# Altium schematic sheet Tetris.SchDoc
size B; DocumentNumber: 1; SheetNumber: 1; SheetTotal: 1
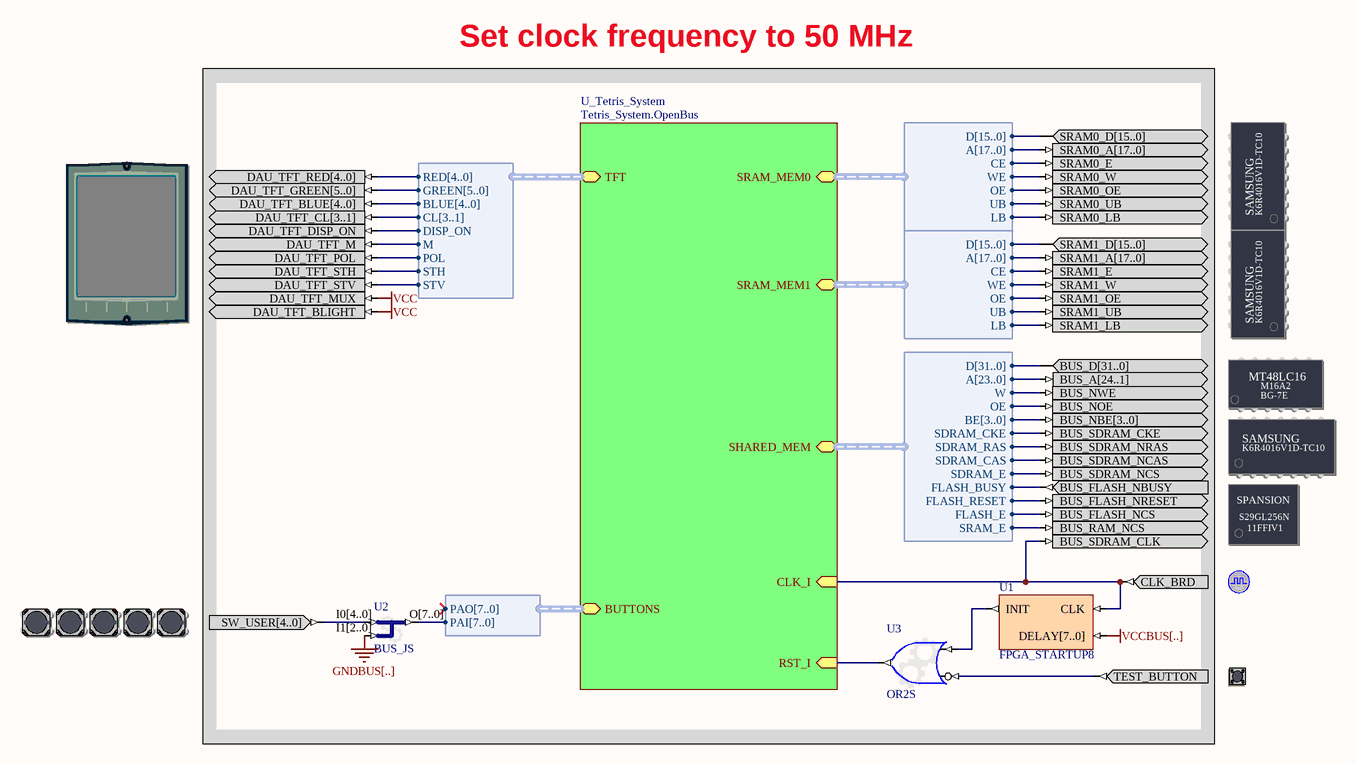
[diagram p0: Tetris.SchDoc]

## Parts
(Parts that share a designator on the sheet are numbered #1, #2 ... from top to bottom, then left to right.)
?#1  SRAM_DAUGHTER0  (value not drawn)
?#2  TFT_LCD  (value not drawn)
?#3  SRAM_DAUGHTER1  (value not drawn)
?#4  SHARED_MEM_DAUGHTER  (value not drawn)
?#5  CLOCK_BOARD  (value not drawn)
?#6  USER_BUTTONS  (value not drawn)
?#7  TEST_BUTTON  (value not drawn)
U1  FPGA_STARTUP8
U2  BUS_JS
U3  OR2S

## Blocks framed on the sheet
Set clock frequency to 50 MHz: ?#1-?#7 U1-U3

## Sub-sheets
U_Tetris_System = Tetris_System.OpenBus: CLK_I (in), RST_I (in), BUTTONS (harness WB_PRTIO_IO_1_1), TFT (harness VGA32_TFT), SRAM_MEM0 (harness WB_MEM_CTRL_SRAM16_A18), SRAM_MEM1 (harness WB_MEM_CTRL_SRAM16_A18), SHARED_MEM (harness WB_SHARED_MEM_CTRL)

## Harnesses
VGA32_TFT: RED[4..0], GREEN[5..0], BLUE[4..0], CL[3..1], DISP_ON, M, POL, STH, STV
WB_PRTIO_IO_1_1: PAO[7..0], PAI[7..0]
WB_MEM_CTRL_SRAM16_A18: D[15..0], A[17..0], CE, WE, OE, UB, LB
WB_SHARED_MEM_CTRL: D[31..0], A[23..0], W, OE, BE[3..0], SDRAM_CKE, SDRAM_RAS, SDRAM_CAS, SDRAM_E, FLASH_BUSY, FLASH_RESET, FLASH_E, SRAM_E

## Nets
GNDBUS[..]: U2.I1[2..0]
VCC: ?#2.DAU_TFT_BLIGHT ?#2.DAU_TFT_MUX
VCCBUS[..]: U1.DELAY[7..0]
Net?#1_SRAM0_A[17..0]: ?#1.SRAM0_A[17..0] ; sheet U_Tetris_System/SRAM_MEM0.A[17..0]
Net?#1_SRAM0_D[15..0]: ?#1.SRAM0_D[15..0] ; sheet U_Tetris_System/SRAM_MEM0.D[15..0]
Net?#1_SRAM0_E: ?#1.SRAM0_E ; sheet U_Tetris_System/SRAM_MEM0.CE
Net?#1_SRAM0_LB: ?#1.SRAM0_LB ; sheet U_Tetris_System/SRAM_MEM0.LB
Net?#1_SRAM0_OE: ?#1.SRAM0_OE ; sheet U_Tetris_System/SRAM_MEM0.OE
Net?#1_SRAM0_UB: ?#1.SRAM0_UB ; sheet U_Tetris_System/SRAM_MEM0.UB
Net?#1_SRAM0_W: ?#1.SRAM0_W ; sheet U_Tetris_System/SRAM_MEM0.WE
Net?#2_DAU_TFT_BLUE[4..0]: ?#2.DAU_TFT_BLUE[4..0] ; sheet U_Tetris_System/TFT.BLUE[4..0]
Net?#2_DAU_TFT_CL[3..1]: ?#2.DAU_TFT_CL[3..1] ; sheet U_Tetris_System/TFT.CL[3..1]
Net?#2_DAU_TFT_DISP_ON: ?#2.DAU_TFT_DISP_ON ; sheet U_Tetris_System/TFT.DISP_ON
Net?#2_DAU_TFT_GREEN[5..0]: ?#2.DAU_TFT_GREEN[5..0] ; sheet U_Tetris_System/TFT.GREEN[5..0]
Net?#2_DAU_TFT_M: ?#2.DAU_TFT_M ; sheet U_Tetris_System/TFT.M
Net?#2_DAU_TFT_POL: ?#2.DAU_TFT_POL ; sheet U_Tetris_System/TFT.POL
Net?#2_DAU_TFT_RED[4..0]: ?#2.DAU_TFT_RED[4..0] ; sheet U_Tetris_System/TFT.RED[4..0]
Net?#2_DAU_TFT_STH: ?#2.DAU_TFT_STH ; sheet U_Tetris_System/TFT.STH
Net?#2_DAU_TFT_STV: ?#2.DAU_TFT_STV ; sheet U_Tetris_System/TFT.STV
Net?#3_SRAM1_A[17..0]: ?#3.SRAM1_A[17..0] ; sheet U_Tetris_System/SRAM_MEM1.A[17..0]
Net?#3_SRAM1_D[15..0]: ?#3.SRAM1_D[15..0] ; sheet U_Tetris_System/SRAM_MEM1.D[15..0]
Net?#3_SRAM1_E: ?#3.SRAM1_E ; sheet U_Tetris_System/SRAM_MEM1.CE
Net?#3_SRAM1_LB: ?#3.SRAM1_LB ; sheet U_Tetris_System/SRAM_MEM1.LB
Net?#3_SRAM1_OE: ?#3.SRAM1_OE ; sheet U_Tetris_System/SRAM_MEM1.OE
Net?#3_SRAM1_UB: ?#3.SRAM1_UB ; sheet U_Tetris_System/SRAM_MEM1.UB
Net?#3_SRAM1_W: ?#3.SRAM1_W ; sheet U_Tetris_System/SRAM_MEM1.WE
Net?#4_BUS_A[24..1]: ?#4.BUS_A[24..1] ; sheet U_Tetris_System/SHARED_MEM.A[23..0]
Net?#4_BUS_D[31..0]: ?#4.BUS_D[31..0] ; sheet U_Tetris_System/SHARED_MEM.D[31..0]
Net?#4_BUS_FLASH_NBUSY: ?#4.BUS_FLASH_NBUSY ; sheet U_Tetris_System/SHARED_MEM.FLASH_BUSY
Net?#4_BUS_FLASH_NCS: ?#4.BUS_FLASH_NCS ; sheet U_Tetris_System/SHARED_MEM.FLASH_E
Net?#4_BUS_FLASH_NRESET: ?#4.BUS_FLASH_NRESET ; sheet U_Tetris_System/SHARED_MEM.FLASH_RESET
Net?#4_BUS_NBE[3..0]: ?#4.BUS_NBE[3..0] ; sheet U_Tetris_System/SHARED_MEM.BE[3..0]
Net?#4_BUS_NOE: ?#4.BUS_NOE ; sheet U_Tetris_System/SHARED_MEM.OE
Net?#4_BUS_NWE: ?#4.BUS_NWE ; sheet U_Tetris_System/SHARED_MEM.W
Net?#4_BUS_RAM_NCS: ?#4.BUS_RAM_NCS ; sheet U_Tetris_System/SHARED_MEM.SRAM_E
Net?#4_BUS_SDRAM_CKE: ?#4.BUS_SDRAM_CKE ; sheet U_Tetris_System/SHARED_MEM.SDRAM_CKE
Net?#4_BUS_SDRAM_CLK: ?#4.BUS_SDRAM_CLK ?#5.CLK_BRD U1.CLK ; sheet U_Tetris_System/CLK_I
Net?#4_BUS_SDRAM_NCAS: ?#4.BUS_SDRAM_NCAS ; sheet U_Tetris_System/SHARED_MEM.SDRAM_CAS
Net?#4_BUS_SDRAM_NCS: ?#4.BUS_SDRAM_NCS ; sheet U_Tetris_System/SHARED_MEM.SDRAM_E
Net?#4_BUS_SDRAM_NRAS: ?#4.BUS_SDRAM_NRAS ; sheet U_Tetris_System/SHARED_MEM.SDRAM_RAS
Net?#6_SW_USER[4..0]: ?#6.SW_USER[4..0] U2.I0[4..0]
Net?#7_TEST_BUTTON: ?#7.TEST_BUTTON U3.I1
NetU1_INIT: U1.INIT U3.I0
NetU2_O[7..0]: U2.O[7..0] ; sheet U_Tetris_System/BUTTONS.PAI[7..0]
NetU3_O: U3.O ; sheet U_Tetris_System/RST_I

## Notes on the sheet
- Title
- Size:
- Date:
- B
- Number:
- Time:
- Revision:
- Sheet
- of
- File:
- (in symbol SHARED_MEM_DAUGHTER) MT48LC16; M16A2; BG-7E; SAMSUNG; K6R4016V1D-TC10; SPANSION; S29GL256N; 11FFIV1
- (in symbol SRAM_DAUGHTER0) SAMSUNG; K6R4016V1D-TC10
- (in symbol SRAM_DAUGHTER1) SAMSUNG; K6R4016V1D-TC10

## Library data of the parts
?#1 = SRAM_DAUGHTER0: Free Static RAM - Daughterboard; PortComponent: True; Published: 14-May-2007; Publisher: Altium Limited; HelpURL: TR0143 NanoBoard Technical Reference Manual - NB2.pdf#page=24
?#2 = TFT_LCD: TFT LCD Panel; PortComponent: True; Published: 22-Jan-2007; Publisher: Altium Limited; HelpURL: TR0143 Technical Reference Manual for Altium's Desktop NanoBoard NB2DSK01.pdf#page=50
?#3 = SRAM_DAUGHTER1: Free Static RAM - Daughterboard; PortComponent: True; Published: 14-May-2007; Publisher: Altium Limited; HelpURL: TR0143 NanoBoard Technical Reference Manual - NB2.pdf#page=24
?#4 = SHARED_MEM_DAUGHTER: Shared Memory - Daughterboard; PortComponent: True; Published: 14-May-2007; Publisher: Altium Limited; HelpURL: TR0149 Technical Reference for Altium's Xilinx Spartan-3 Daughter Board DB30.pdf#page=15
?#5 = CLOCK_BOARD: Global System Clock Supply; PortComponent: True; Published: 19-Nov-2003; Publisher: Altium Limited; HelpURL: TR0143 Technical Reference Manual for Altium's Desktop NanoBoard NB2DSK01.pdf#page=41; UseInDSF: True
?#6 = USER_BUTTONS: Generic User Buttons; PortComponent: True; Published: 16-Apr-2007; Publisher: Altium Limited; HelpURL: TR0143 Technical Reference Manual for Altium's Desktop NanoBoard NB2DSK01.pdf#page=53
?#7 = TEST_BUTTON: Test / Reset Button; PortComponent: True; Published: 19-Nov-2003; Publisher: Altium Limited; HelpURL: TR0143 Technical Reference Manual for Altium's Desktop NanoBoard NB2DSK01.pdf#page=53
U1 = FPGA_STARTUP8: FPGA Startup With 8 Bit Delay; Published: 9-Dec-2004; Publisher: Altium Limited; HelpURL: CR0119 FPGA_STARTUPx Powerup Delay Unit.pdf; LastRevisionNo: 1.00.00; ComponentLink1Description: Core &Resource Usage; ComponentLink1URL: CR0139 FPGA Peripheral Resource Usage.pdf#page=11
U2 = BUS_JS: Configurable Bus Joiner/Splitter; ConfiguratorName: GENERIC_BUS_JS; ConfigurationParameters: {}Version[1.0]{}SplitterJoinerType[Joiner]{}SignalCount[2]{}SignalWidth0[5]{}SignalWidth1[3]{}; LastRevisionNo: 1.00.00; Published: 17-Sep-2008; Publisher: Altium Limited
U3 = GATE: Configurable Generic Gate; ConfiguratorName: GENERIC_GATE; ConfigurationParameters: {}Version[1.0]{}GateKind[OR]{}BusInput[False]{}GateInputType[Bit]{}GateOutputOption[Normal]{}BusWidth[8]{}RegisterOutputs[False]{}NegativeClockEdge[False]{}InputCount[2]{}InputInvert0[False]{}InputInvert1[True]{}; LastRevisionNo: 1.00.00; Published: 3-Sep-2008; Publisher: Altium Limited